# Altium project Project_1B.PrjPcb
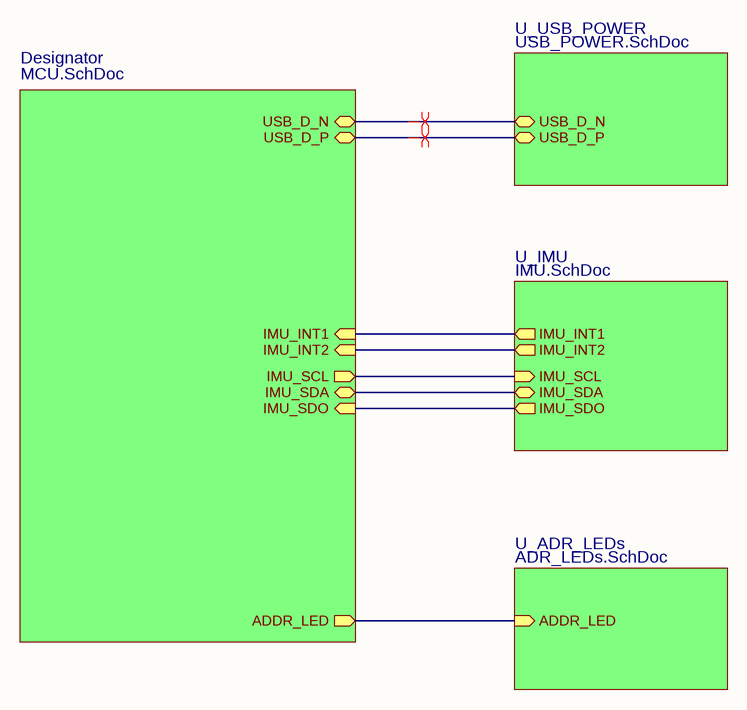
[diagram p0: STM32 Project 1B.SchDoc]
5 sheets, 47 parts. Net scope: hierarchical (ports join the sheet entries above them; power ports are global).
Board file: STM32 Project 1B.PcbDoc
Sheets:
  STM32 Project 1B.SchDoc
    Designator = MCU.SchDoc
    U_IMU = IMU.SchDoc
    U_USB_POWER = USB_POWER.SchDoc
    U_ADR_LEDs = ADR_LEDs.SchDoc

## Sheet STM32 Project 1B.SchDoc
size A4; SheetNumber: 1; SheetTotal: 5

### Sub-sheets
Designator = MCU.SchDoc: USB_D_N (bidir), USB_D_P (bidir), IMU_INT1 (in), IMU_INT2 (in), IMU_SCL (out), IMU_SDA (bidir), IMU_SDO (in), ADDR_LED (out)
U_ADR_LEDs = ADR_LEDs.SchDoc: ADDR_LED (in)
U_IMU = IMU.SchDoc: IMU_INT1 (out), IMU_INT2 (out), IMU_SCL (in), IMU_SDA (bidir), IMU_SDO (out)
U_USB_POWER = USB_POWER.SchDoc: USB_D_N (bidir), USB_D_P (bidir)

### Nets
ADDR_LED: sheet Designator/ADDR_LED, sheet U_ADR_LEDs/ADDR_LED
IMU_INT1: sheet Designator/IMU_INT1, sheet U_IMU/IMU_INT1
IMU_INT2: sheet Designator/IMU_INT2, sheet U_IMU/IMU_INT2
IMU_SCL: sheet Designator/IMU_SCL, sheet U_IMU/IMU_SCL
IMU_SDA: sheet Designator/IMU_SDA, sheet U_IMU/IMU_SDA
IMU_SDO: sheet Designator/IMU_SDO, sheet U_IMU/IMU_SDO
USB_D_N: sheet Designator/USB_D_N, sheet U_USB_POWER/USB_D_N
USB_D_P: sheet Designator/USB_D_P, sheet U_USB_POWER/USB_D_P

### Layout directives
differential pair: USB_D_N, USB_D_P

## Sheet MCU.SchDoc: MCU Schematic
size A4; Date: 25 July 2024; Author: Ibrahim Oladepo; DrawnBy: Ibrahim Oladepo; SheetNumber: 2; SheetTotal: 5
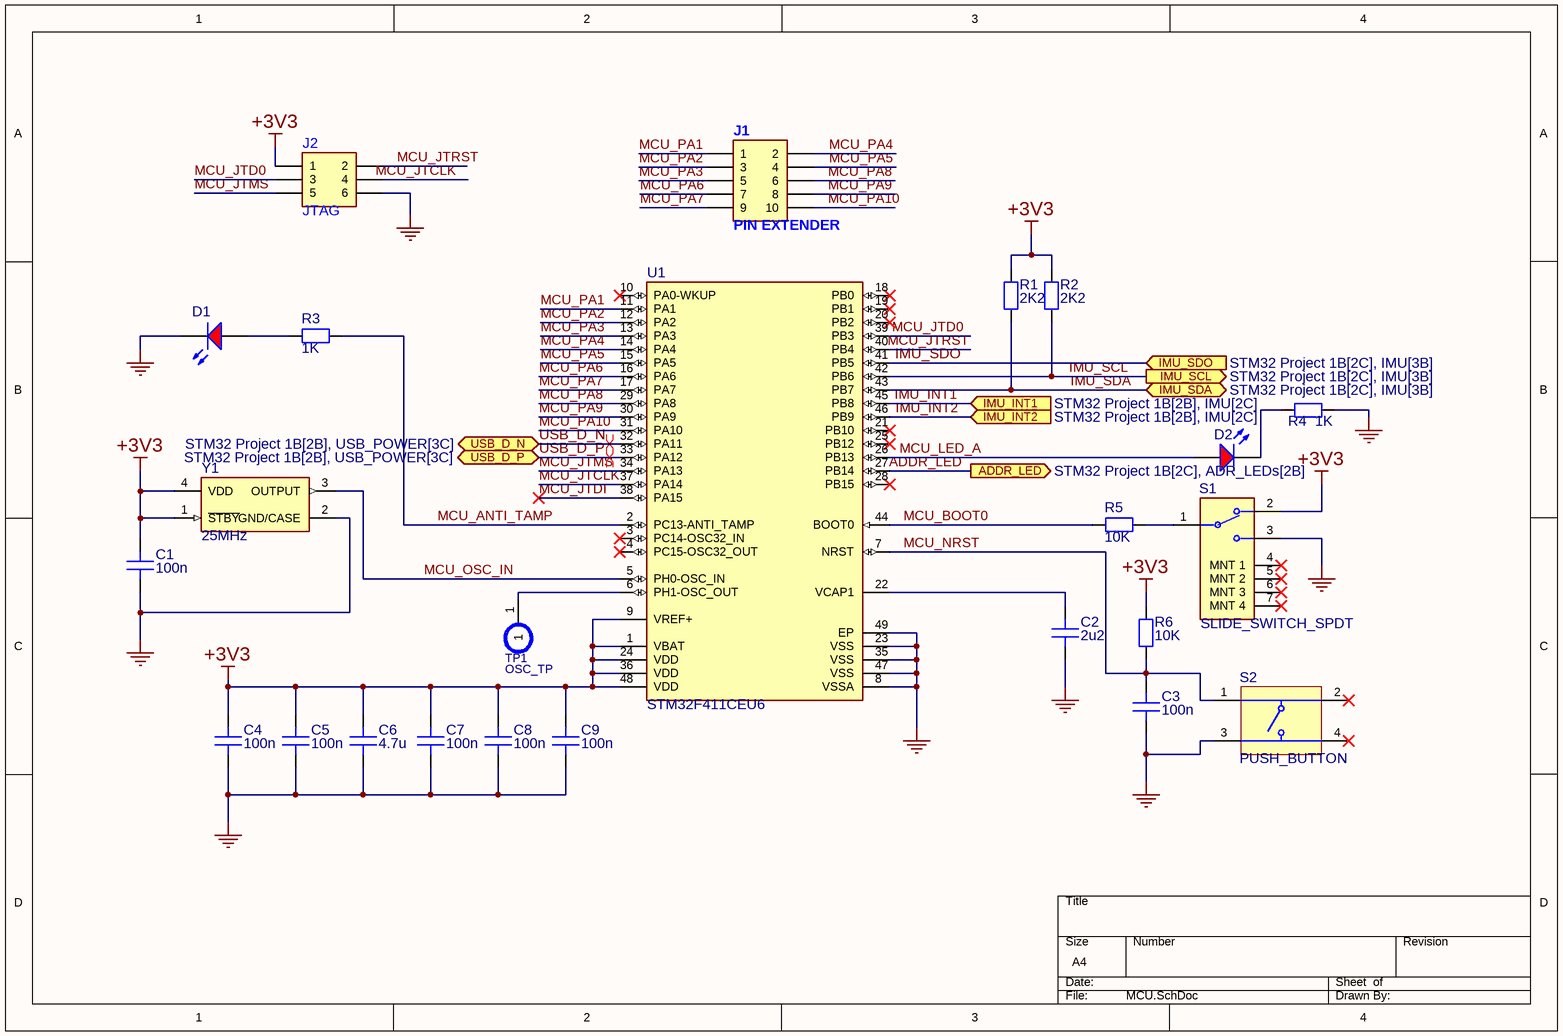
[diagram p1: MCU.SchDoc]

### Parts
C1  100n  [CAP_0805]
C2  2u2  [CAP_0805]
C3  100n  [CAP_0805]
C4  100n  [CAP_0805]
C5  100n  [CAP_0805]
C6  4.7u  [CAP_0805]
C7  100n  [CAP_0805]
C8  100n  [CAP_0805]
C9  100n  [CAP_0805]
D1  LED_RED_0805  [LED_RED_0805]  (value not drawn)
D2  LED_RED_0805  [LED_RED_0805]  (value not drawn)
J1  PIN EXTENDER  [10P_2x5_HEADER]
J2  JTAG  [6P_2x3_HEADER]
R1  2K2  [RES_0805]
R2  2K2  [RES_0805]
R3  1K  [RES_0805]
R4  1K  [RES_0805]
R5  10K  [RES_0805]
R6  10K  [RES_0805]
S1  SLIDE_SWITCH_SPDT  [SLIDE_SWITCH_SPDT]
S2  PUSH_BUTTON  [PUSH_BUTTON]
TP1  OSC_TP  [TEST_POINT_SMD]  (no BOM)
U1  STM32F411CEU6  [STM32F411CEU6]
Y1  25MHz  [XTAL_OSCILLATOR_25MHz]

### Ports
ADDR_LED (out, see STM32 Project 1B[2C], ADR_LEDs[2B]), IMU_INT1 (in, see STM32 Project 1B[2B], IMU[2C]), IMU_INT2 (in, see STM32 Project 1B[2B], IMU[2C]), IMU_SCL (out, see STM32 Project 1B[2C], IMU[3B]), IMU_SDA (bidir, see STM32 Project 1B[2C], IMU[3B]), IMU_SDO (in, see STM32 Project 1B[2C], IMU[3B]), USB_D_N (bidir, see STM32 Project 1B[2B], USB_POWER[3C]), USB_D_P (bidir, see STM32 Project 1B[2B], USB_POWER[3C])

### Nets
+3V3: C1.2 C4.2 C5.2 C6.2 C7.2 C8.2 C9.2 J2.1 R1.1 R2.1 R6.1 S1.2 U1.1(VBAT) U1.9(VREF+) U1.24(VDD) U1.36(VDD) U1.48(VDD) Y1.1(~{STBY}) Y1.4(VDD)
GND: C1.1 C2.1 C3.1 C4.1 C5.1 C6.1 C7.1 C8.1 C9.1 D1.1(K) J2.6 R4.1 S1.3 S2.3 U1.8(VSSA) U1.23(VSS) U1.35(VSS) U1.47(VSS) U1.49(EP) Y1.2(GND/CASE)
ADDR_LED: U1.27(PB14) ; port ADDR_LED
IMU_INT1: U1.45(PB8) ; port IMU_INT1
IMU_INT2: U1.46(PB9) ; port IMU_INT2
IMU_SCL: R2.2 U1.42(PB6) ; port IMU_SCL
IMU_SDA: R1.2 U1.43(PB7) ; port IMU_SDA
IMU_SDO: U1.41(PB5) ; port IMU_SDO
MCU_ANTI_TAMP: R3.1 U1.2(PC13-ANTI_TAMP)
MCU_BOOT0: R5.2 U1.44(BOOT0)
MCU_JTCLK: J2.4 U1.37(PA14)
MCU_JTD0: J2.3 U1.39(PB3)
MCU_JTDI: U1.38(PA15)
MCU_JTMS: J2.5 U1.34(PA13)
MCU_JTRST: J2.2 U1.40(PB4)
MCU_LED_A: D2.2(A) U1.26(PB13)
MCU_NRST: C3.2 R6.2 S2.1 U1.7(NRST)
MCU_OSC_IN: U1.5(PH0-OSC_IN) Y1.3(OUTPUT)
MCU_PA1: J1.1 U1.11(PA1)
MCU_PA2: J1.3 U1.12(PA2)
MCU_PA3: J1.5 U1.13(PA3)
MCU_PA4: J1.2 U1.14(PA4)
MCU_PA5: J1.4 U1.15(PA5)
MCU_PA6: J1.7 U1.16(PA6)
MCU_PA7: J1.9 U1.17(PA7)
MCU_PA8: J1.6 U1.29(PA8)
MCU_PA9: J1.8 U1.30(PA9)
MCU_PA10: J1.10 U1.31(PA10)
USB_D_N: U1.32(PA11) ; port USB_D_N
USB_D_P: U1.33(PA12) ; port USB_D_P
NetC2_2: C2.2 U1.22(VCAP1)
NetD1_2: D1.2(A) R3.2
NetD2_1: D2.1(K) R4.2
NetR5_1: R5.1 S1.1
NetTP1_1: TP1.1 U1.6(PH1-OSC_OUT)

Not connected (* = marked no-connect by the designer): S1 4(MNT_1)* 5(MNT_2)* 6(MNT_3)* 7(MNT_4)*; S2 2* 4*; U1 3(PC14-OSC32_IN)* 4(PC15-OSC32_OUT)* 10(PA0-WKUP)* 18(PB0)* 19(PB1)* 20(PB2)* 21(PB10)* 25(PB12)* 28(PB15)*

### Layout directives
differential pair: USB_D_N, USB_D_P

### Library data of the parts
C1-C9 = CAP_0805: Capacitor SMD 0805 Generic; Manufacturer: *; Manufacturer Part Number: *; Tolerance: *; Voltage Rating: *; Dielectric: *
D1 D2 = LED_RED_0805: Chip LED, Green, 2.2 V, -40 to 85 degC, 2-Pin SMD, Pb-Free, Tape and Reel; NexarPartId: 29717781; Peak Wavelength: 630nm; Wavelength: 625nm; Viewing Angle: 140°; Test Current: 20mA; Forward Voltage: 2V; Forward Current: 100mA; Lens Style: Clear, Rectangular; Color: Red; Luminous Intensity: 150mcd; Max Reverse Voltage (DC): 5V; Length: 2mm; Case Code (Imperial): 0805; RoHS: Compliant; Max Operating Temperature: 85°C; Height: 700µm; Packaging: Tape and Reel; Case/Package: 0805; REACH SVHC: Unknown; Dominant Wavelength: 625nm; Min Operating Temperature: -40°C; Case Code (Metric): 2012; Mount: Surface Mount; Width: 1.25mm
J1 = 10P_2x5_HEADER: 10 Position SMD Pin Header 2x5
J2 = 6P_2x3_HEADER: Male Header, Pitch 2.54 mm, 2 x 3 Position, Height 8.13 mm, -65 to 125 degC, RoHS, Tube; Max Supply Voltage: 5.5 V; Min Supply Voltage: 4.5 V; Nominal Supply Voltage: 5 V; Min Operating Temperature: -40 degC; ComponentLink1URL: http://www.te.com/; ComponentLink2Description: Datasheet; Pins: 3; Max Operating Temperature: 150 degC; PackageDescription: Male Header, Pitch 2.54 mm, 2 x 3 Position, Height 8.13 mm; Package Quantity: 3000; PackageReference: 5-146130-2; DatasheetVersion: Oct-15; ComponentLink1Description: Manufacturer URL; Radiation Hardening: No; Mount: Surface Mount; RoHSCompliant: true; Packaging: Tape and Reel; ComponentLink2URL: http://www.te.com/commerce/DocumentDelivery/DDEController?Action=showdoc&DocId=Customer+Drawing%7F146130%7FM%7Fpdf%7FEnglish%7FENG_CD_146130_M.pdf%7F5-146130-2
R1-R6 = RES_0805: Resistor SMD 0805 Generic; Manufacturer: *; Manufacturer Part Number: *; Tolerance: *; Package Size: *; Voltage Rating: *
S1 = SLIDE_SWITCH_SPDT: SWITCH SLIDE SPDT 300MA 6V; Manufacturer: *; Manufacturer Part Number: *; Max Current: 300mA; Max Voltage: 6V
S2 = PUSH_BUTTON: Micro Miniature Push Button Switch FSM JSM, 50 mA, -35 to 85 degC, 4-Pin SMD, RoHS, Tape and Reel; Manufacturer: TE Connectivity; Mechanical Life: 100000Cycles; Current Rating: 50mA; Actuator Material: Polyamide; Max Voltage Rating (DC): 12V; Capacitance: 0f; Illumination Type: Illuminated; Voltage Rating (DC): 24V; Case\/Package: SMD/SMT; Operating Force: 160gf; Contact Resistance: 100mOhm; Actuator Length: 0.055inch; Switch Travel: 0.25mm; Throw Configuration: SPST; Termination: GullWing; Contact Plating: Silver; Orientation: Straight; Mounting Technology: SurfaceMount; REACH SVHC: Unknown; Electrical Life: 100000Cycles; Package Reference: FSM4JSMATR; Max Operating Temperature: 85degC; Manufacturer URL: http://www.te.com/; Package Description: 4-Pin Surface Mount Device, Body 6 x 6 mm, Pitch 4.5 mm; Datasheet Version: Rev. V, 02/2015; Packaging: TapeandReel; Min Operating Temperature: -35degC; Mount: SurfaceMount; Contact Current Rating: 50mA; Contact Material: CopperAlloy; Package Quantity: 1200; Datasheet URL: http://www.te.com/commerce/DocumentDelivery/DDEController?Action=showdoc&DocId=Customer+Drawing%7F2-1437565-7%7FV%7Fpdf%7FEnglish%7FENG_CD_2-1437565-7_V.pdf%7F4-1437565-2; RoHSCompliant: true
TP1 = TEST_POINT_SMD: Test Point SMD Generic - for in circuit test
U1 = STM32F411CEU6: ARM Cortex-M4 32-bit MCU+FPU, 512 KB Flash, 128 KB RAM, 36 I/Os, 48-Pin UFQFPN, -40 to 85 degC, Tray; Operating Frequency(F) (Processor speed) (MHz): 100; FLASH Size (Prog) (kB): 512; Internal RAM Size (kB): 128; I/Os (High Current): 36; Supply Voltage(Vcc) min (V): 1.7; Package Reference: 48-Pin Ultra Thin Fine Pitch Quad Flat No-Lead, 7 x 7 x 0.6 mm Body, 0.5 mm Pitch, Exposed Pad; ComponentLink1Description: Manufacturer URL; ComponentLink1URL: http://www.st.com/; Packing: Tray; Package Description: UFQFPN48; Core: ARM Cortex-M4; ComponentLink2Description: Datasheet; ComponentLink2URL: http://www.st.com/st-web-ui/static/active/en/resource/technical/document/datasheet/DM00115249.pdf; DatasheetVersion: Rev. 6; Mounting Technology: Surface Mount
Y1 = XTAL_OSCILLATOR_25MHz: XTAL Oscillator 25MHz ±50ppm CMOS 3.3V 4-SMD 3.2mm x 2.5mm; Load Capacitance: 15pF; Min Supply Voltage: 3.135V; Max Supply Voltage: 3.465V; Max Supply Current: 13mA; Max Operating Temperature: 85°C; Termination: SMD/SMT; Operating Frequency: 25 MHz; Height: 0.047inch; Frequency: 25MHz; Mount: Surface Mount; Number of Pins: 4; Length: 3.2mm; Packaging: Tape and Reel; Frequency Stability: 50ppm; Series: ASE; Radiation Hardening: No; Package Quantity: 1000; Width: 2.5mm; Min Operating Temperature: -40°C; Lead Free: Lead Free; Case/Package: SMD/SMT; Depth: 2.5mm; Operating Supply Voltage: 3.3V

## Sheet IMU.SchDoc
size A4; SheetNumber: 3; SheetTotal: 5
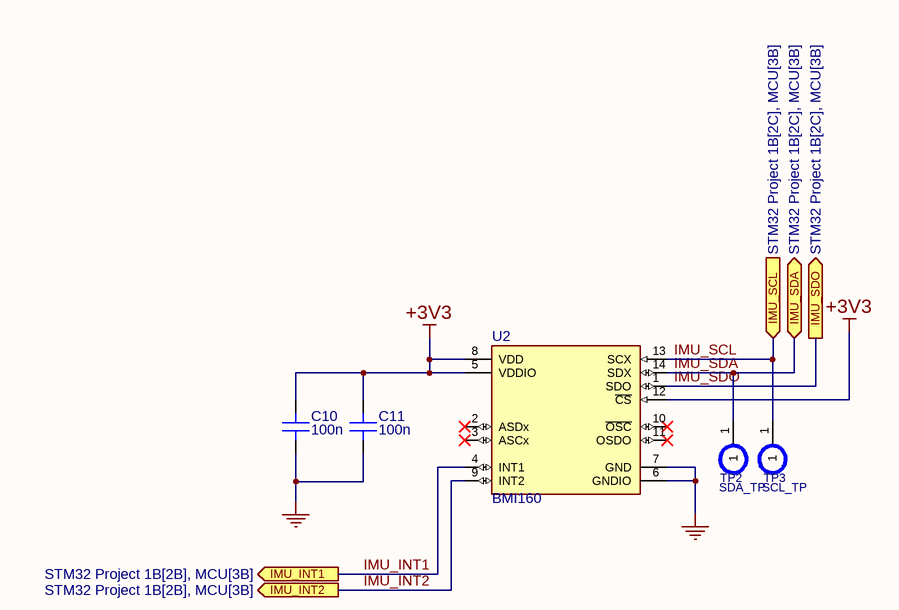
[diagram p2: IMU.SchDoc]

### Parts
C10  100n  [CAP_0805]
C11  100n  [CAP_0805]
TP2  SDA_TP  [TEST_POINT_SMD]  (no BOM)
TP3  SCL_TP  [TEST_POINT_SMD]  (no BOM)
U2  BMI160  [BMI160]

### Ports
IMU_INT1 (out, see STM32 Project 1B[2B], MCU[3B]), IMU_INT2 (out, see STM32 Project 1B[2B], MCU[3B]), IMU_SCL (in, see STM32 Project 1B[2C], MCU[3B]), IMU_SDA (bidir, see STM32 Project 1B[2C], MCU[3B]), IMU_SDO (out, see STM32 Project 1B[2C], MCU[3B])

### Nets
+3V3: C10.2 C11.2 U2.5(VDDIO) U2.8(VDD) U2.12(~{CS})
GND: C10.1 C11.1 U2.6(GNDIO) U2.7(GND)
IMU_INT1: U2.4(INT1) ; port IMU_INT1
IMU_INT2: U2.9(INT2) ; port IMU_INT2
IMU_SCL: TP3.1 U2.13(SCX) ; port IMU_SCL
IMU_SDA: TP2.1 U2.14(SDX) ; port IMU_SDA
IMU_SDO: U2.1(SDO) ; port IMU_SDO

Not connected (* = marked no-connect by the designer): U2 2(ASDx)* 3(ASCx)* 10(~{OSC})* 11(OSDO)*

### Library data of the parts
C10 C11 = CAP_0805: Capacitor SMD 0805 Generic; Manufacturer: *; Manufacturer Part Number: *; Tolerance: *; Voltage Rating: *; Dielectric: *
TP2 TP3 = TEST_POINT_SMD: as TP1 on sheet MCU
U2 = BMI160: IMU ACCEL/GYRO I2C/SPI 14LGA; Sensor Type: Accelerometer; Output Type: SPI; Mount: Surface Mount; Max Operating Temperature: 85°C; Case/Package: LGA; Min Operating Temperature: -40°C; Packaging: Cut Tape; Lead Free: Lead Free

## Sheet USB_POWER.SchDoc
size A4; SheetNumber: 4; SheetTotal: 5
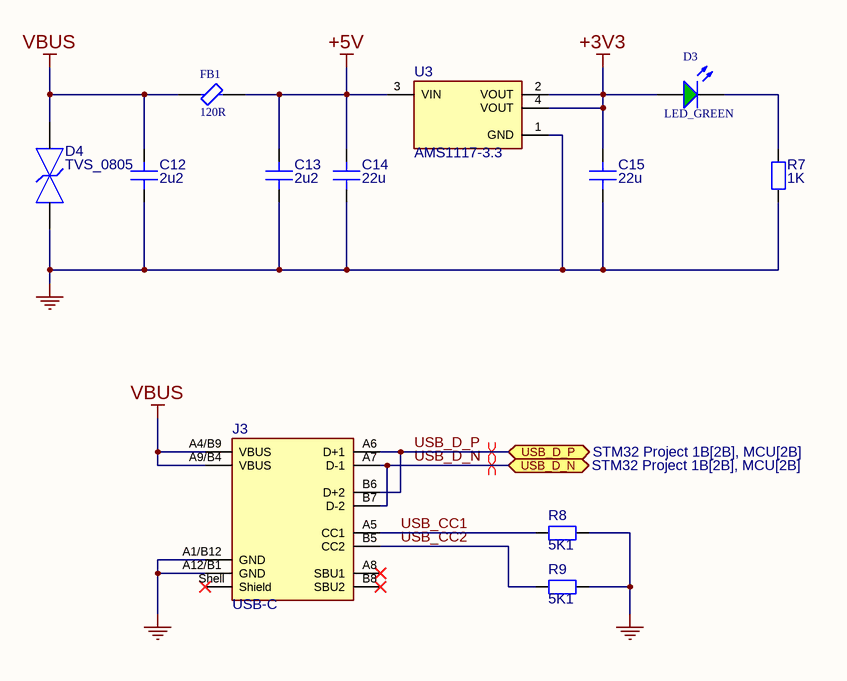
[diagram p3: USB_POWER.SchDoc]

### Parts
C12  2u2  [CAP_0805]
C13  2u2  [CAP_0805]
C14  22u  [CAP_0805]
C15  22u  [CAP_0805]
D3  LED_GREEN  [LED_GREEN_0805]
D4  TVS_0805  [TVS_0805]
FB1  120R  [FERRITE_BEAD_0805]
J3  USB-C  [USB-C SMD 16 Pin]
R7  1K  [RES_0402]
R8  5K1  [RES_0805]
R9  5K1  [RES_0805]
U3  AMS1117-3.3  [AMS1117-3.3]

### Ports
USB_D_N (bidir, see STM32 Project 1B[2B], MCU[2B]), USB_D_P (bidir, see STM32 Project 1B[2B], MCU[2B])

### Nets
+3V3: C15.2 D3.1(A) U3.2(VOUT) U3.4(VOUT)
+5V: C13.2 C14.2 FB1.2 U3.3(VIN)
GND: C12.1 C13.1 C14.1 C15.1 D4.1 J3.A1/B12(GND) J3.A12/B1(GND) R7.1 R8.2 R9.2 U3.1(GND)
VBUS: C12.2 D4.2 FB1.1 J3.A4/B9(VBUS) J3.A9/B4(VBUS)
USB_CC1: J3.A5(CC1) R8.1
USB_CC2: J3.B5(CC2) R9.1
USB_D_N: J3.A7(D-1) J3.B7(D-2) ; port USB_D_N
USB_D_P: J3.A6(D+1) J3.B6(D+2) ; port USB_D_P
NetD3_2: D3.2(K) R7.2

Not connected (* = marked no-connect by the designer): J3 A8(SBU1)* B8(SBU2)* Shell(Shield)*

### Layout directives
differential pair: USB_D_N, USB_D_P

### Library data of the parts
C12-C15 = CAP_0805: Capacitor SMD 0805 Generic; Manufacturer: *; Manufacturer Part Number: *; Tolerance: *; Voltage Rating: *; Dielectric: *
D3 = LED_GREEN_0805: Chip LED, Green, 2.2 V, -40 to 85 degC, 2-Pin SMD, Pb-Free, Tape and Reel; Manufacturer: Avago; No. of Pins: 2; Peak Wavelength: 570nm; SVHC: NoSVHC(16-Jun-2014); Dominant Wavelength: 572nm; Forward Current If: 20mA; Viewing Angle: 170deg; Lens Shape: Rectangular; PIV Max: 5V; External Width: 1.25mm; LED Type: Standard; External Depth: 0.8mm; Opto Mounting Orientation: Top; Luminous Intensity: 15mcd; Luminous Intensity Min: 4mcd; Forward Voltage VF Max: 2.6V; External Length / Height: 2mm; Bulb Size: 1.25mmx1.4mm; Light Area Height: 1mm; Voltage Vf Typ: 2.2V; Operating Temperature Max: 85degC; Datasheet Version: Oct-08; MSL: MSL2A-4weeks; Peak Forward Current: 20mA; Package Description: 2-Pin Surface Mount Device, Body 2 x 1.25 mm, Height 0.8 mm; Datasheet URL: https://datasheet.ciiva.com/29280/180495-da-01-en-chip-led-hsmg-c170-gelb-gruen-29280971.pdf; Storage Temperature Min: -40degC; LED Colour: Green; Wavelength Typ: 570nm; Mounting Type: SMD; Forward Current If Max: 20mA; Dominant Wavelength Typ: 572nm; LED Mounting: SMD; Operating Temperature Range: -30degCto+85degC; Operating Temperature Min: -30degC; Manufacturer URL: http://www.avagotech.com/; Packaging: CutTape; Luminous Intensity Typ: 15mcd; Package Reference: HSMX-C170; Storage Temperature Max: 85degC; Opto Case Style: SMD; Forward Voltage: 2.2V
D4 = TVS_0805: ESD Suppressor SMD 0805; Manufacturer: Panasonic; Manufacturer Part Number: EZA-EG2A50AX; Clamping Voltage: 100V; Direction: Bidirectional; Reverse Standoff Voltage: 30V; Capacitance: 0.05pF; Value: 0.05pF; Number Of Channels: 1; Category: Diode; Package: EZAEG2A; RoHS: TRUE; Lead Free: Yes; Digikey Description: VARISTOR 0402; Temperature: -55°C to +125°C; Mouser Description: ESD Suppressors 15V 0402 SUPPRESSOR ESD; Automotive: No; Temperature Range High: +125°C; Octopart: https://octopart.com/eza-eg2a50ax-panasonic-39557977; Device Class L2: TVS Diodes; ComponentLink2Description: Datasheet; Temperature Range Low: -55°C; Ipc Land Pattern Name: INDC10050X38; Device Class L1: Circuit Protection; ComponentLink2URL: https://industrial.panasonic.com/cdbs/www-data/pdf/AWD0000/AWD0000C23.pdf; Device Class L3: unset; Height: 0.43mm
FB1 = FERRITE_BEAD_0805: FERRITE BEAD 120 OHM 0805 1LN; Number of Lines: 1; DC Resistance-Max: 100mR; Material: Steel; Max DC Current: 200mA; Shielding: Unshielded; Test Frequency: 100MHz; Current Rating: 800mA; Max Current Rating: 1A; Resistance: 150mR; Tolerance: 25%; Width: 1.25mm; Number of Circuits: 1; Military Standard: Not; Height: 0.85mm; Series: BLM21A; Min Operating Temperature: -55°C; DC Resistance (DCR): 100mR; Termination: SMD/SMT; Impedance: 120R; Core Material: Ferrite; REACH SVHC: No SVHC; Radiation Hardening: No; Max Operating Temperature: 125°C; Number of Pins: 2; Case/Package: 0805; Case Code (Imperial): 0805; Frequency: 100MHz; Depth: 1.25mm; Length: 2mm; DC Current: 200mA; Lead Free: Lead Free; Case Code (Metric): 2012; Package Quantity: 1; Packaging: Tape and Reel
J3 = USB-C SMD 16 Pin: Usb Conn, 2.0 Type C, R/A Rcpt, 16P, Smt Rohs Compliant: Yes |Wurth Elektronik 629722000214; Manufacturer: Wurth Electronics; USB Standard: USB 2.0; Current Rating: 5A; Gender: Receptacle; Insulation Resistance: 100MR; Number of Contacts: 12; Voltage Rating: 20V; Pin Length: 950um; Supplier: Newark; Supplier Part Number: 69AK2245; Manufacturer Part Number: 629722000214; RoHS: No; Stock: 1749; Pricing: 1=4.22, 10=3.98, 25=3.76, 50=3.47, 100=3.17, 250=2.8 (USD); Pins: 16; Contact Material: Nickel,Gold; Min Operating Temperature: -40°C; Max Operating Temperature: 85°C; Packaging: Tape and Reel; Height: 3.51mm; ComponentLink1URL: https://datasheet.octopart.com/629722000214-Wurth-Elektronik-datasheet-168263062.pdf?src-supplier=Element14; ComponentLink1Description: https://datasheet.octopart.com/629722000214-Wurth-Elektronik-datasheet-168263062.pdf?src-supplier=Element14
R7-R9 = RES_0805: Resistor SMD 0805 Generic; Manufacturer: *; Manufacturer Part Number: *; Tolerance: *; Package Size: *; Voltage Rating: *
U3 = AMS1117-3.3: LDO Voltage Regulators 1A, 3.3V; Manufacturer: Advanced Monolithic Systems; Dropout Voltage: 1.1V; Output Type: Fixed; Nominal Supply Current: 5mA; Max Power Dissipation: 1.2W; Max Supply Voltage: 15V; Number Of Outputs: 1; Standoff Height: 0.64mm; Max Junction Temp: +125°C; Height: 1.8mm; Package: AMS1117; Device Class L2: Power Management ICs; ComponentLink2Description: Datasheet; ComponentLink2URL: http://www.advanced-monolithic.com/pdf/ds1117.pdf; Category: IC; RoHS: TRUE; Automotive: No; Device Class L1: Integrated Circuits (ICs); Output Current: 1A; Device Class L3: Voltage Regulators - Linear; Temperature: -40°C to +125°C; Output Voltage: 3.3V; Manufacturer Part Number: AMS1117-3.3; Temperature Range Low: -40°C; Octopart: https://octopart.com/ams1117-3.3-advanced+monolithic+systems-25899300; Lead Free: Yes; Ipc Land Pattern Name: SOT229P700X180-4; Temperature Range High: +125°C

## Sheet ADR_LEDs.SchDoc
size A4; SheetNumber: 5; SheetTotal: 5
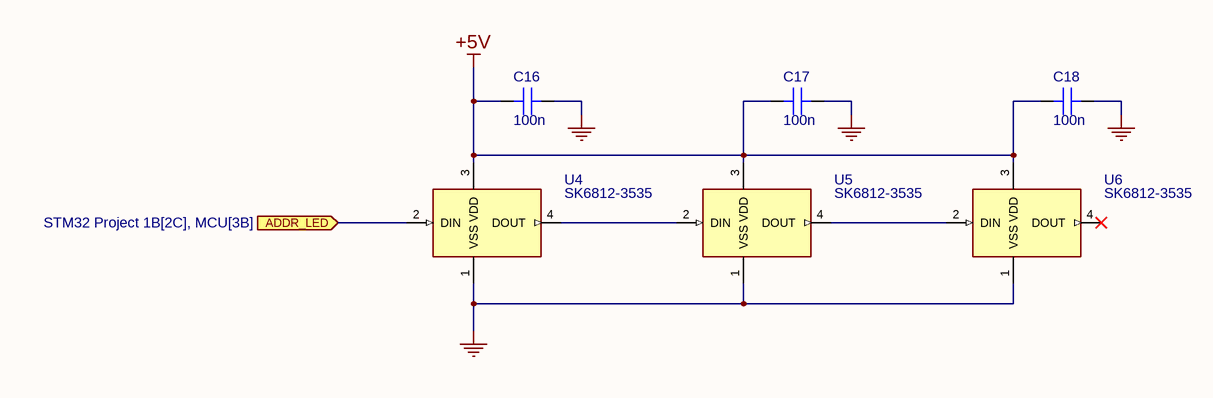
[diagram p4: ADR_LEDs.SchDoc]

### Parts
C16  100n  [CAP_0805]
C17  100n  [CAP_0805]
C18  100n  [CAP_0805]
U4  SK6812-3535  [SK6812-3535]
U5  SK6812-3535  [SK6812-3535]
U6  SK6812-3535  [SK6812-3535]

### Ports
ADDR_LED (in, see STM32 Project 1B[2C], MCU[3B])

### Nets
+5V: C16.2 C17.2 C18.2 U4.3(VDD) U5.3(VDD) U6.3(VDD)
GND: C16.1 C17.1 C18.1 U4.1(VSS) U5.1(VSS) U6.1(VSS)
ADDR_LED: U4.2(DIN) ; port ADDR_LED
NetU4_4: U4.4(DOUT) U5.2(DIN)
NetU5_4: U5.4(DOUT) U6.2(DIN)

Not connected (* = marked no-connect by the designer): U6 4(DOUT)*

### Library data of the parts
C16-C18 = CAP_0805: Capacitor SMD 0805 Generic; Manufacturer: *; Manufacturer Part Number: *; Tolerance: *; Voltage Rating: *; Dielectric: *
U4-U6 = SK6812-3535: NeoPixel 5050 RGB LED with Integrated Driver Chip - 10 Pack | Adafruit Industries 1655; Manufacturer Part Number: 1655; Number of LEDs: 10; Interface: Serial; Supplier: Digikey; Supplier Part Number: 1528-1104-ND; Manufacturer: Adafruit Industries; RoHS: Yes; Category: LEDs; Stock: 1730; Pricing: 1=4.5 (USD); Mounting Technology: Surface Mount; Color: Blue,Green,Red; Min Operating Temperature: -40°C; Max Operating Temperature: 85°C; Series: Neopixel; Length: 5mm; Width: 5mm; Height: 1.6mm; ComponentLink1URL: http://www.mouser.com/ds/2/737/SK6812_LED_datasheet_-953546.pdf?src-supplier=Mouser; ComponentLink1Description: http://www.mouser.com/ds/2/737/SK6812_LED_datasheet_-953546.pdf?src-supplier=Mouser; ComponentLink2URL: https://cdn-shop.adafruit.com/product-files/1138/SK6812+LED+datasheet+.pdf?src-supplier=Digikey; ComponentLink2Description: https://cdn-shop.adafruit.com/product-files/1138/SK6812+LED+datasheet+.pdf?src-supplier=Digikey

## Nets that join several sheets
+3V3: MCU (19 pins), IMU (5 pins), USB_POWER (C15.2 D3.1 U3.2 U3.4)
+5V: USB_POWER (C13.2 C14.2 FB1.2 U3.3), ADR_LEDs (6 pins)
GND: MCU (20 pins), IMU (C10.1 C11.1 U2.6 U2.7), USB_POWER (11 pins), ADR_LEDs (6 pins)
ADDR_LED: MCU (U1.27), ADR_LEDs (U4.2)
IMU_INT1: MCU (U1.45), IMU (U2.4)
IMU_INT2: MCU (U1.46), IMU (U2.9)
IMU_SCL: MCU (R2.2 U1.42), IMU (TP3.1 U2.13)
IMU_SDA: MCU (R1.2 U1.43), IMU (TP2.1 U2.14)
IMU_SDO: MCU (U1.41), IMU (U2.1)
USB_D_N: MCU (U1.32), USB_POWER (J3.A7 J3.B7)
USB_D_P: MCU (U1.33), USB_POWER (J3.A6 J3.B6)